# Altium schematic sheet v2.0.SchDoc
size 266 x 88 mm; PageSetup: Record=PageOptions|CenterHorizontal=True|CenterVertical=True|PrintScale=1.28|XCorrection=1.00|YCorrection=1.00|PrintKind=0|BorderSize=5000000|LeftOffset=0|BottomOffset=0|Orientation=2|PaperLength=1000|PaperWidth=1000|Scale=100|PaperSource=7|PrintQuality=-3|MediaType=1|DitherType=10|PrintScaleMode=1|PaperKind=A4|PaperIndex=9
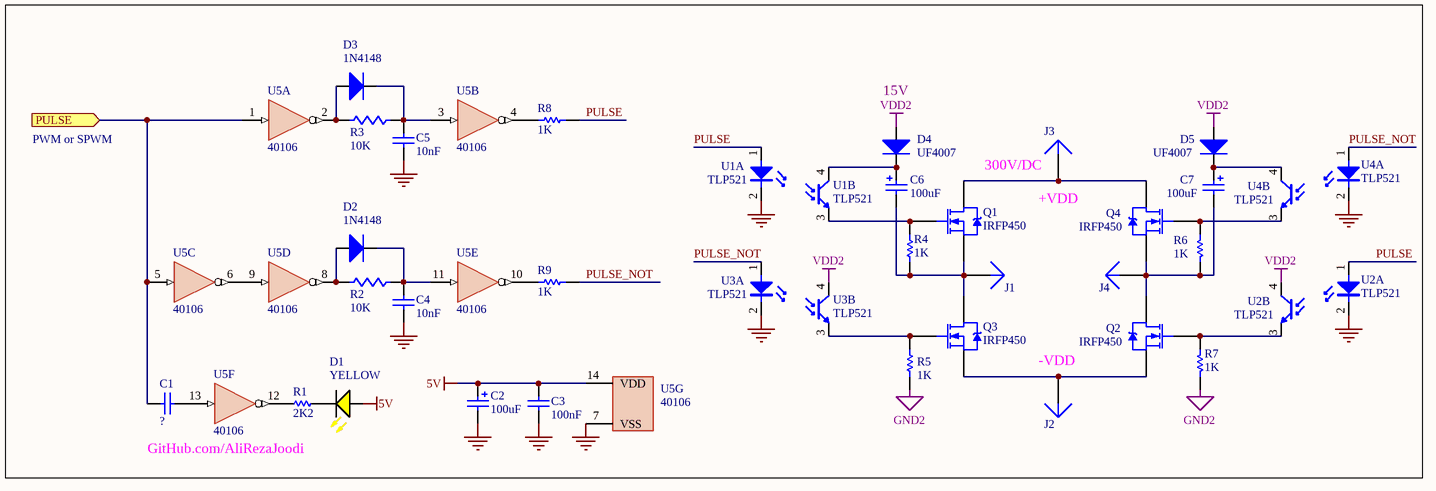
[diagram p0: v2.0.SchDoc]

## Parts
C1  ?  [CAPNTO2.54-3.05x1.78A]
C2  value 100uF  [CAPPR2.5-6.3x5]  (hidden comment: Cap Pol1)
C3  value 100nF  [CAPNTO2.54-3.05x1.78A]  (hidden comment: Cap)
C4  value 10nF  [CAPNTO2.54-3.05x1.78A]  (hidden comment: Cap)
C5  value 10nF  [CAPNTO2.54-3.05x1.78A]  (hidden comment: Cap)
C6  value 100uF  [CAPPR2.5-6.3x5]  (hidden comment: Cap Pol1)
C7  value 100uF  [CAPPR2.5-6.3x5]  (hidden comment: Cap Pol1)
D1  YELLOW  [LED_THD_5MM_YELLOW]
D2  1N4148  [DIODE0.4_Glass]
D3  1N4148  [DIODE0.4_Glass]
D4  UF4007  [DIODE-0.4]
D5  UF4007  [DIODE-0.4]
J1  COAX-M  [PIN1]  (value not drawn)
J2  COAX-M  [PIN1]  (value not drawn)
J3  COAX-M  [PIN1]  (value not drawn)
J4  COAX-M  [PIN1]  (value not drawn)
Q1  IRFP450  [TO247AC]
Q2  IRFP450  [TO247AC]
Q3  IRFP450  [TO247AC]
Q4  IRFP450  [TO247AC]
R1  2K2  [R_THD_AXIAL0.4(1/4W)]
R2  value 10K  [AXIAL-0.4]  (hidden comment: Res1)
R3  value 10K  [AXIAL0.4]  (hidden comment: Res1)
R4  value 1K  [AXIAL-0.4]  (hidden comment: RES)
R5  value 1K  [AXIAL-0.4]  (hidden comment: RES)
R6  value 1K  [AXIAL-0.4]  (hidden comment: RES)
R7  value 1K  [AXIAL-0.4]  (hidden comment: RES)
R8  value 1K  [AXIAL-0.4]  (hidden comment: RES)
R9  value 1K  [AXIAL-0.4]  (hidden comment: RES)
U1  TLP521  [DIP-4]  (parts A,B of 2)
U2  TLP521  [DIP-4]  (parts A,B of 2)
U3  TLP521  [DIP-4]  (parts A,B of 2)
U4  TLP521  [DIP-4]  (parts A,B of 2)
U5  40106  [DIP_14]  (parts A,B,C,D,E,F,G of 7)

## Ports
PULSE (in)

## Nets
5V: C2.1 C3.1 D1.1(A) U5.14(VDD)
GND: C2.2 C3.2 C4.2 C5.2 U1.2(K) U2.2(K) U3.2(K) U4.2(K) U5.7(VSS)
GND2: R5.2 R7.2
VDD2: D4.1(A) D5.1(A) U2.4(C) U3.4(C)
PULSE: R8.1 U1.1(A) U2.1(A)
PULSE: C1.1 U5.1(I) U5.5(I) ; port PULSE  [a separate net that carries the same name]
PULSE_NOT: R9.1 U3.1(A) U4.1(A)
NetC1_2: C1.2 U5.13(I)
NetC4_1: C4.1 D2.2(K) R2.2 U5.11(I)
NetC5_1: C5.1 D3.2(K) R3.2 U5.3(I)
NetC6_1: C6.1 D4.2(K) U1.4(C)
NetC6_2: C6.2 J1.1(A) Q1.3(S) Q3.2(D) R4.1
NetC7_1: C7.1 D5.2(K) U4.4(C)
NetC7_2: C7.2 J4.1(A) Q2.2(D) Q4.3(S) R6.1
NetD1_2: D1.2(K) R1.2
NetD2_1: D2.1(A) R2.1 U5.8(~{O})
NetD3_1: D3.1(A) R3.1 U5.2(~{O})
NetJ2_1: J2.1(A) Q2.3(S) Q3.3(S)
NetJ3_1: J3.1(A) Q1.2(D) Q4.2(D)
NetQ1_1: Q1.1(G) R4.2 U1.3(E)
NetQ2_1: Q2.1(G) R7.1 U2.3(E)
NetQ3_1: Q3.1(G) R5.1 U3.3(E)
NetQ4_1: Q4.1(G) R6.2 U4.3(E)
NetR1_1: R1.1 U5.12(~{O})
NetR8_2: R8.2 U5.4(~{O})
NetR9_2: R9.2 U5.10(~{O})
NetU5_6: U5.6(~{O}) U5.9(I)

## Notes on the sheet
- (near D4) 15V
- PWM or SPWM
- 300V/DC
- (near J3) +VDD
- (near J2) -VDD
- GitHub.com/AliRezaJoodi

## Library data of the parts
C1 = Cap: Capacitor; Manufacturer: Generic Components; Class I: Passive; Value: 10nF; Published: 8-Jun-2000; Revision: July-2002: Re-released for DXP Platform.; Publisher: Altium Limited; Class II: Capacitor
C2 C6 C7 = Cap Pol1: Polarized Capacitor (Radial); Manufacturer: Generic Components; Class I: Passive; Published: 8-Jun-2000; Revision: July-2002: Re-released for DXP Platform.; Publisher: Altium Limited; Class II: Capacitor
C3-C5 = Cap: Capacitor; Manufacturer: Generic Components; Class I: Passive; Published: 8-Jun-2000; Revision: July-2002: Re-released for DXP Platform.; Publisher: Altium Limited; Class II: Capacitor
D1 = LED_YELLOW: LED, Yellow; Manufacturer: Generic Components; Class I: Optoelectronic; Published: 8-Jun-2000; Revision: July-2002: Re-released for DXP Platform.; Publisher: Altium Limited; Class II: LED
D2-D5 = Diode: Default Diode; Manufacturer: Generic Components; Class I: Discrete; Class II: Diode - Switching; Published: 8-Jun-2000; Revision: July-2002: Re-released for DXP Platform.; Publisher: Altium Limited
  D2 D3: Value: 1N4148
J1-J4 = COAX-M: Coax-M Connector; Manufacturer: Generic Components; Revision: July-2002: Re-released for DXP Platform.; Publisher: Altium Limited; Class I: Connector
Q1-Q4 = NMOS-2: N-Channel Power MOSFET; Manufacturer: Generic Components; Class I: Discrete; Class II: MOSFET - Power; Note: Pin 2 is electrically connected to pin 4.; Published: 8-Jun-2000; Revision: July-2002: Re-released for DXP Platform.; Datasheet: Latest Revision: PD-9.814; Package Reference: TO-220AB; Publisher: Altium Limited
R1 = Resistor: Revision: July-2002: Re-released for DXP Platform.
R2-R9 = Res1: Resistor; Manufacturer: Generic Components; Class I: Passive; Published: 8-Jun-2000; Revision: July-2002: Re-released for DXP Platform.; Publisher: Altium Limited; Class II: Resistor
U1-U4 = Optoisolator: Publisher: Altium Limited; Value: TLP521
U5 = 40106: Hex inverting Schmitt trigger, 14-Pin; Publisher: Altium Limited; ComponentLink1URL: http://www.nxp.com